# Altium schematic sheet energy_router_panel_#3.SchDoc
size A4
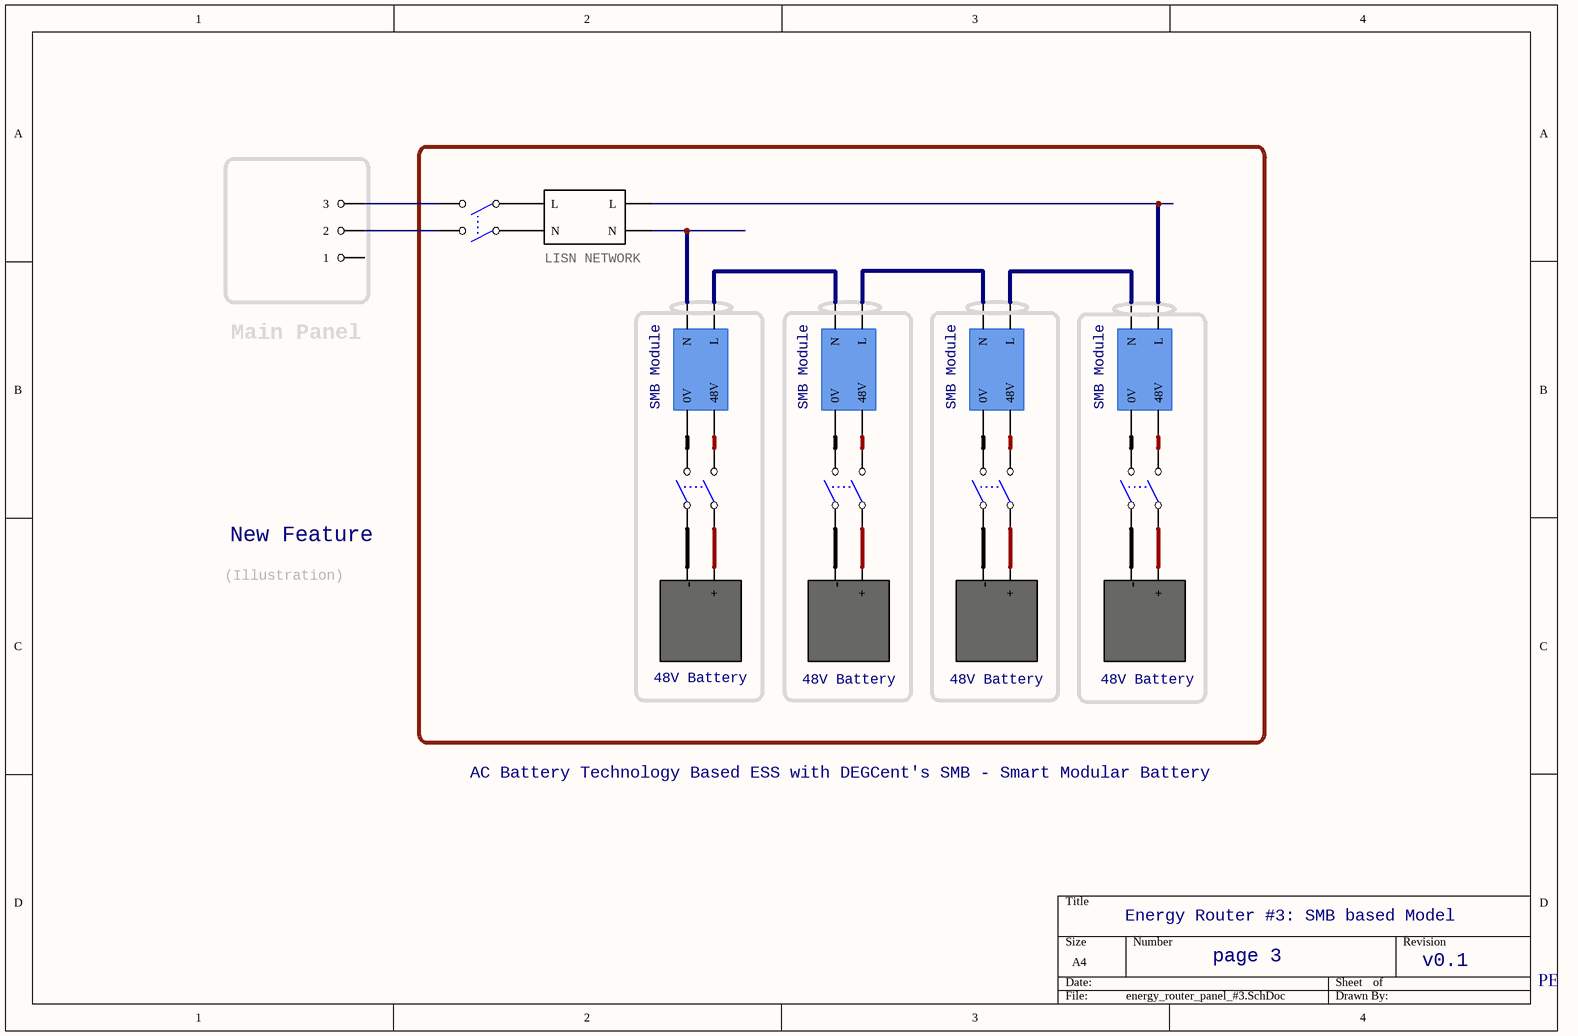
[diagram p0: energy_router_panel_#3.SchDoc]

## Parts
300  3 HEADER  (value not drawn)
Battery302  48V Battery
Battery_301  48V Battery
Battery_303  48V Battery
Battery_304  48V Battery
K300  Switch  (value not drawn)
K301  Switch  (value not drawn)
K302  Switch  (value not drawn)
K303  Switch  (value not drawn)
K304  Switch  (value not drawn)
U301  SMB Module
U302  SMB Module
U303  SMB Module
U304  SMB Module
U321  LISN NETWORK

## Nets
Net300_2: 300.2 K300.2
Net300_3: 300.3 K300.4
NetBattery302_1: Battery302.1(-) K302.1
NetBattery302_2: Battery302.2(+) K302.3
NetBattery_301_1: Battery_301.1(-) K301.1
NetBattery_301_2: Battery_301.2(+) K301.3
NetBattery_303_1: Battery_303.1(-) K303.1
NetBattery_303_2: Battery_303.2(+) K303.3
NetBattery_304_1: Battery_304.1(-) K304.1
NetBattery_304_2: Battery_304.2(+) K304.3
NetK301_2: K301.2 U301.4(0V)
NetK301_4: K301.4 U301.5(48V)
NetK302_2: K302.2 U302.4(0V)
NetK302_4: K302.4 U302.5(48V)
NetK303_2: K303.2 U303.4(0V)
NetK303_4: K303.4 U303.5(48V)
NetK304_2: K304.2 U304.4(0V)
NetK304_4: K304.4 U304.5(48V)
NetU301_1: U301.1(N) U321.4(N)
NetU301_2: U301.2(L) U302.1(N)
NetU302_2: U302.2(L) U303.1(N)
NetU303_2: U303.2(L) U304.1(N)
NetU304_2: U304.2(L) U321.5(L)

Not connected (* = marked no-connect by the designer): 300 1; K300 1 3; U321 1(N) 2(L)

## Notes on the sheet
- Main Panel
- (Illustration)
- New Feature
- AC Battery Technology Based ESS with DEGCent's SMB - Smart Modular Battery
- Energy Router #3: SMB based Model
- page 3
- v0.1
- PE

## Library data of the parts
300 = 3 HEADER: 3 Pin Header
Battery302 Battery_301 Battery_303 Battery_304 = 1_BAT_48V
K300-K304 = SW-DPST
U301-U304 = 20_SMB_Module
U321 = 21_LISN_NETWORK